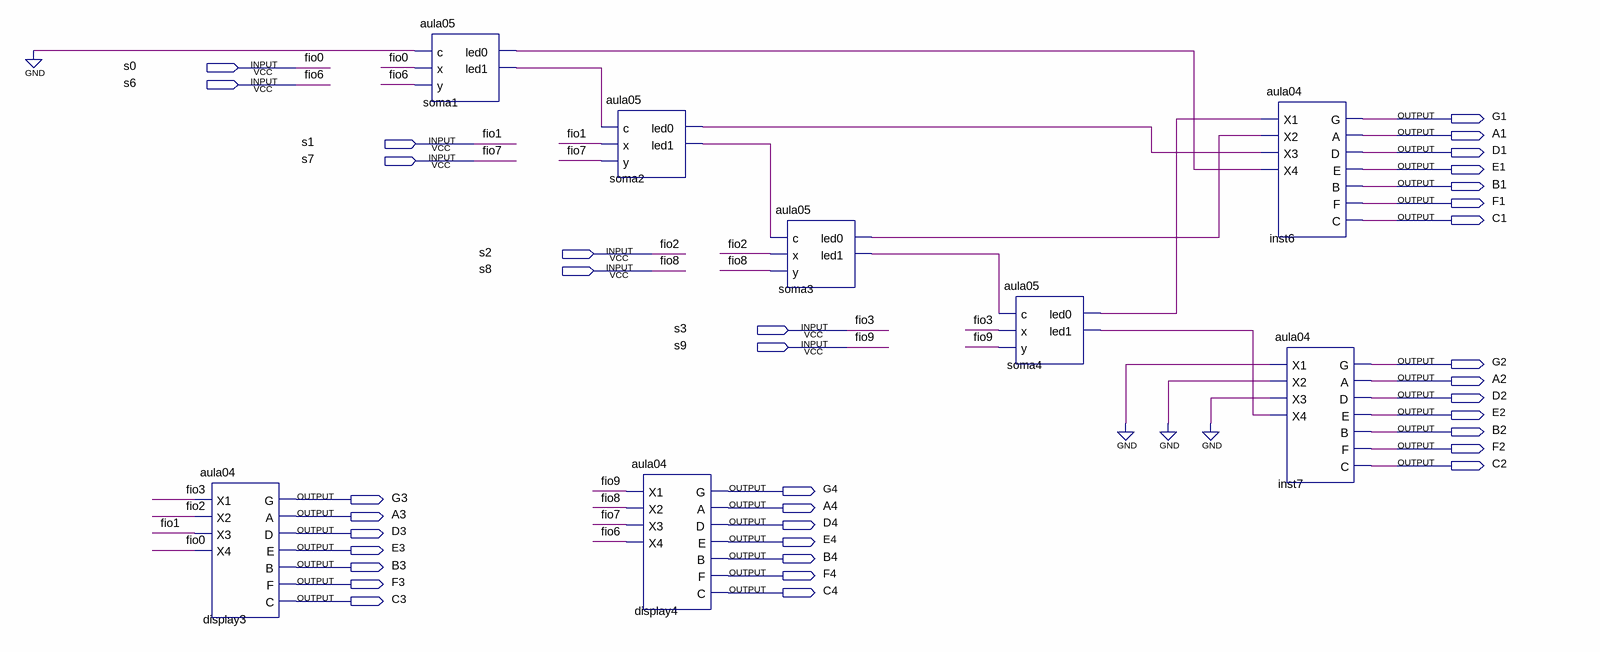
[diagram p0: schematic sheet]
// Quartus schematic aula06.bdf as structural Verilog: 8 symbols, 36 pins
module aula06 (
  input  s0,
  input  s6,
  input  s1,
  input  s7,
  input  s2,
  input  s8,
  input  s3,
  input  s9,
  output G1,
  output A1,
  output D1,
  output E1,
  output B1,
  output F1,
  output C1,
  output G2,
  output A2,
  output D2,
  output E2,
  output B2,
  output F2,
  output C2,
  output G4,
  output G3,
  output A4,
  output A3,
  output D4,
  output D3,
  output E4,
  output E3,
  output B4,
  output B3,
  output F4,
  output F3,
  output C4,
  output C3
);

  wire soma1_led0, soma1_led1, soma2_led0, soma2_led1, soma3_led0, soma3_led1, soma4_led0, soma4_led1;

  aula04 display3 (.X1(s3), .X2(s2), .X3(s1), .X4(s0), .G(G3), .A(A3), .D(D3), .E(E3), .B(B3), .F(F3), .C(C3));
  aula05 soma1 (.c(1'b0), .x(s0), .y(s6), .led0(soma1_led0), .led1(soma1_led1));
  aula05 soma2 (.c(soma1_led1), .x(s1), .y(s7), .led0(soma2_led0), .led1(soma2_led1));
  aula04 display4 (.X1(s9), .X2(s8), .X3(s7), .X4(s6), .G(G4), .A(A4), .D(D4), .E(E4), .B(B4), .F(F4), .C(C4));
  aula05 soma3 (.c(soma2_led1), .x(s2), .y(s8), .led0(soma3_led0), .led1(soma3_led1));
  aula05 soma4 (.c(soma3_led1), .x(s3), .y(s9), .led0(soma4_led0), .led1(soma4_led1));
  aula04 inst6 (
    .X1(soma4_led0), .X2(soma3_led0), .X3(soma2_led0), .X4(soma1_led0), .G(G1), .A(A1), .D(D1), .E(E1),
    .B(B1), .F(F1), .C(C1));
  aula04 inst7 (
    .X1(1'b0), .X2(1'b0), .X3(1'b0), .X4(soma4_led1), .G(G2), .A(A2), .D(D2), .E(E2), .B(B2), .F(F2), .C(C2));

  // Other names for the same wires on the sheet: fio0 = s0; fio1 = s1; fio2 = s2; fio3 = s3; fio6 = s6; fio7 = s7;
  //   fio8 = s8; fio9 = s9
endmodule
